# EAGLE design windrain (EAGLE 5.11)
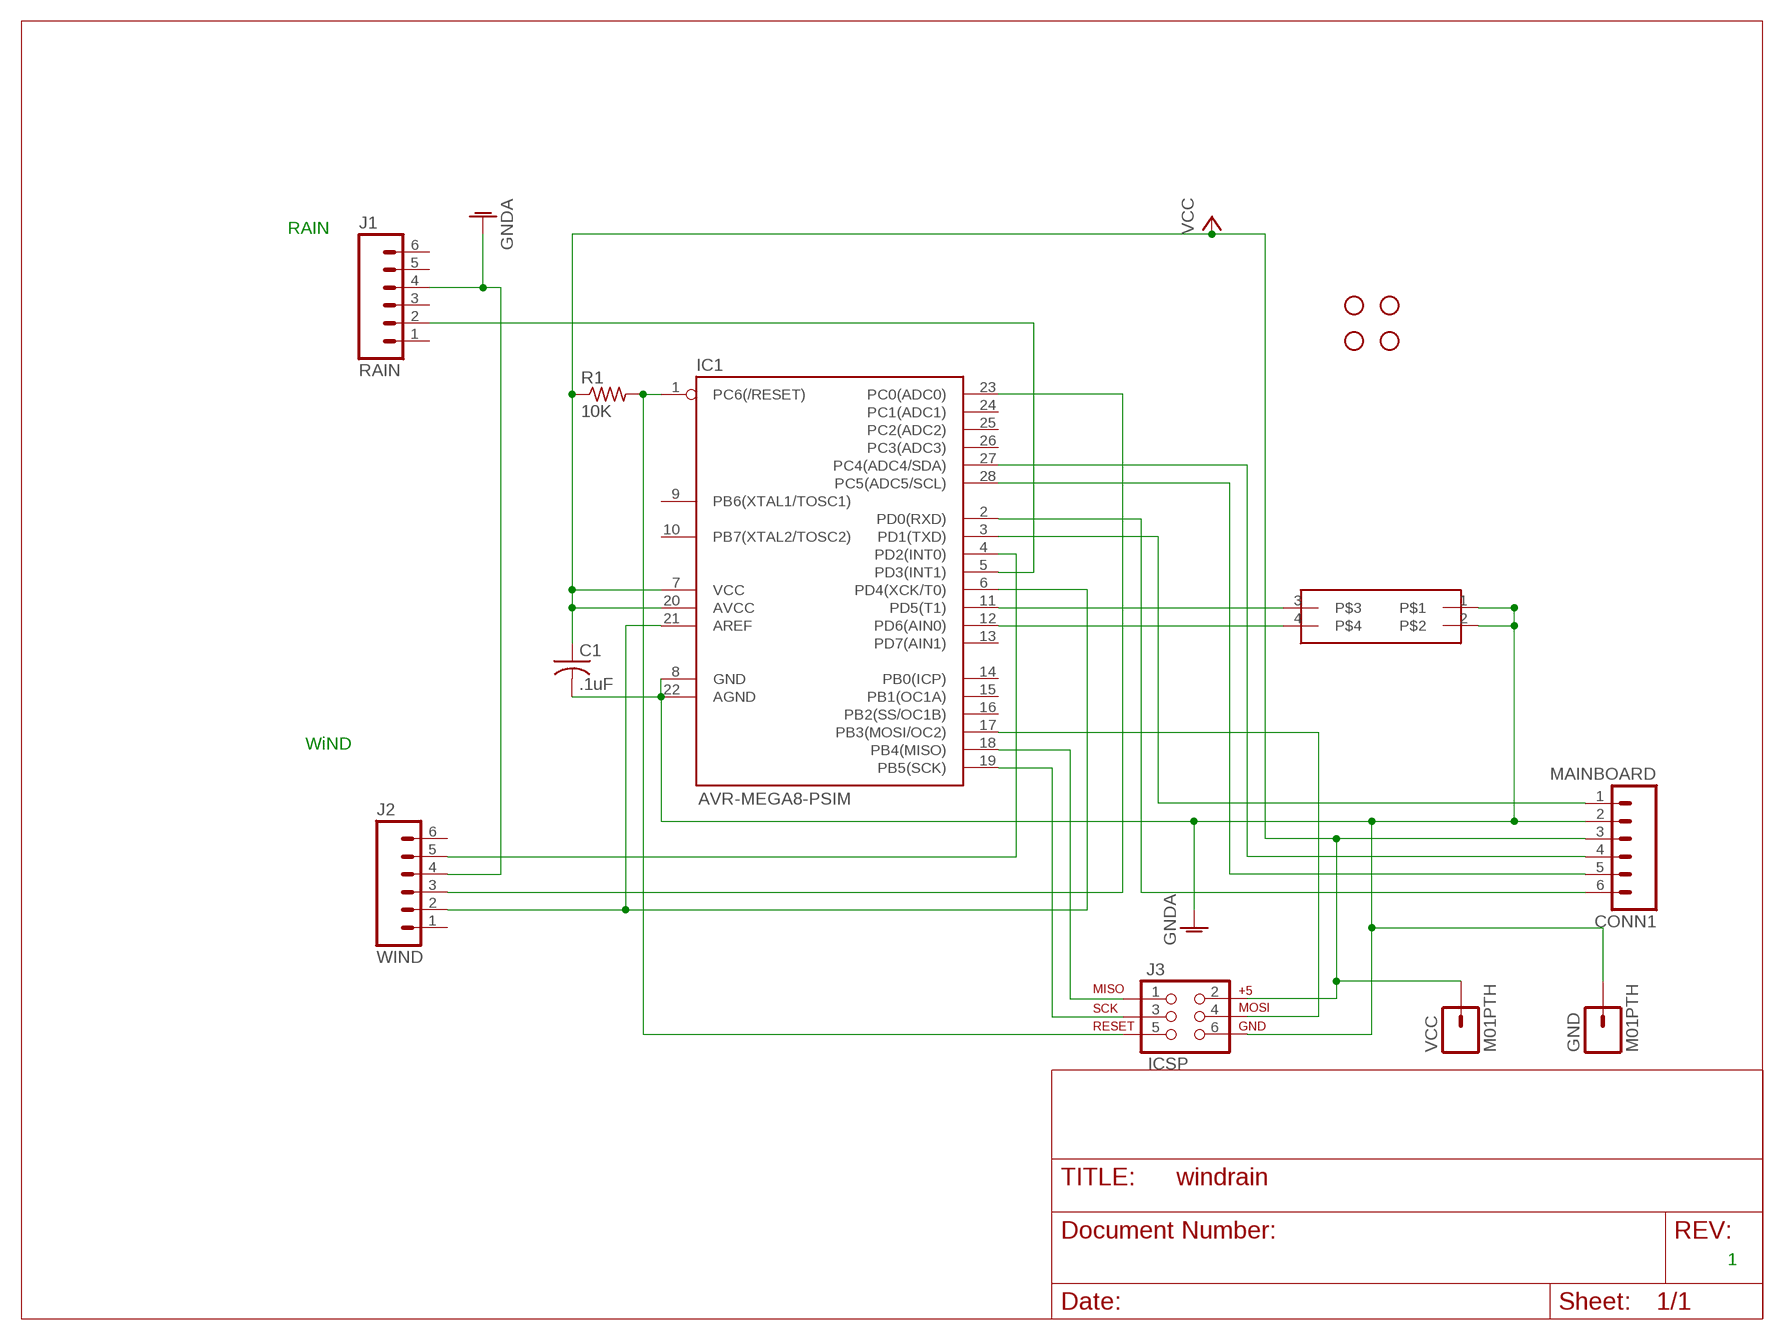
[diagram p0: schematic, sheet 1]

## Parts
C1  .1uF  C-US025-030X050  [C025-030X050]
CONN1  MAINBOARD  M06SIP  [1X06]
GND  M01PTH  [1X01]
IC1  AVR-MEGA8-PSIM  [DIL28-3-SIMON]
J1  RAIN  RJ11-6PTH  [RJ11-6]
J2  WIND  RJ11-6PTH  [RJ11-6]
J3  ICSP  AVR_SPI_PRG_6PTH  [2X3]
JP1  ADDR  PAD2X2  [PAD2X2]
JP2  STAND-OFF  [STAND-OFF]
JP3  STAND-OFF  [STAND-OFF]
JP4  STAND-OFF  [STAND-OFF]
JP5  STAND-OFF  [STAND-OFF]
R1  10K  R-US_0207/7  [0207/7]
VCC  M01PTH  [1X01]

## Nets
GNDA: C1.2 CONN1.2 GND.1 IC1.8(GND) IC1.22(AGND) J1.4 J2.4 J3.6 JP1.1 JP1.2
N$1: IC1.1(PC6(/RESET)) J3.5 R1.2
N$2: IC1.4(PD2(INT0)) J2.5
N$3: IC1.6(PD4(XCK/T0)) IC1.21(AREF) J2.2
N$4: IC1.5(PD3(INT1)) J1.2
N$5: IC1.23(PC0(ADC0)) J2.3
N$6: CONN1.4 IC1.27(PC4(ADC4/SDA))
N$7: CONN1.5 IC1.28(PC5(ADC5/SCL))
N$8: IC1.11(PD5(T1)) JP1.3
N$9: IC1.12(PD6(AIN0)) JP1.4
N$10: CONN1.1 IC1.3(PD1(TXD))
N$11: CONN1.6 IC1.2(PD0(RXD))
N$12: IC1.19(PB5(SCK)) J3.3
N$13: IC1.18(PB4(MISO)) J3.1
N$14: IC1.17(PB3(MOSI/OC2)) J3.4
VCC: C1.1 CONN1.3 IC1.7(VCC) IC1.20(AVCC) J3.2 R1.1 VCC.1
Unconnected: IC1.9(PB6(XTAL1/TOSC1)) IC1.10(PB7(XTAL2/TOSC2)) IC1.13(PD7(AIN1)) IC1.14(PB0(ICP)) IC1.15(PB1(OC1A)) IC1.16(PB2(SS/OC1B)) IC1.24(PC1(ADC1)) IC1.25(PC2(ADC2)) IC1.26(PC3(ADC3)) J1.1 J1.3 J1.5 J1.6 J2.1 J2.6

## Notes on the sheet
- RAIN
- WiND
- 1

## Library data of the parts
C1 = resistor:C-US: CAPACITOR, American symbol
CONN1 = SparkFun:M06: Header 6 Standard 6-pin 0.1" header. Use with straight break away headers (SKU : PRT-00116), right angle break away headers (PRT-00553), swiss pins (PRT-00743), machine pins (PRT-00117), and female headers (PRT-00115). Molex polarized connector foot print use with SKU : PRT-08094 with associated crimp pins and housings. NOTES ON THE VARIANTS LOCK and LOCK_LONGPADS... This footprint was designed to help hold the alignment of a through-hole component (i.e. 6-pin header) while soldering it into place. You may notice that each hole has been shifted either up or down by 0.005 of an inch from it's more standard position (which is a perfectly straight line). This slight alteration caused the pins (the squares in the middle) to touch the edges of the holes. Because they are alternating, it causes a "brace" to hold the component in place. 0.005 has proven to be the perfect amount of "off-center" position when using our standard breakaway headers. Although looks a little odd when you look at the bare footprint, once you have a header in there, the alteration is very hard to notice. Also, if you push a header all the way into place, it is covered up entirely on the bottom side. This idea of altering the position of holes to aid alignment will be further integrated into the Sparkfun Library for other footprints. It can help hold any component with 3 or more connection pins.
GND VCC = SparkFun:M01: Header 1 Standard 1-pin 0.1" header. Use with straight break away headers (SKU : PRT-00116), right angle break away headers (PRT-00553), swiss pins (PRT-00743), machine pins (PRT-00117), and female headers (PRT-00115).
IC1 = SparkFun:AVR-MEGA8-P: MICROCONTROLLER 8 Kbytes FLASH 1 kbytes SRAM 512 bytes EEPROM USART 4-channel 10 bit ADC 2-channel 8 bit ADC
J1 J2 = SparkFun:RJ11-6: RJ11 Jack Simple 6 pin RJ11 jack. Commonly found on CAT3 devices and Microchip programmers. SKU: PRT-00132
J3 = SparkFun:AVR_SPI_PRG_6: AVR ISP 6 Pin This is the reduced ISP connector for AVR programming. Common on Arduino. This footprint will take up less PCB space and can be used with a 10-pin to 6-pin adapter such as SKU: BOB-08508
JP1 = alchemy:PAD2X2
JP2-JP5 = SparkFun:STAND-OFF: Stand Off This is the mechanical footprint for a #4 phillips button head screw. Use the keepout ring to avoid running the screw head into surrounding components. SKU : PRT-00447
R1 = resistor:R-US_: RESISTOR, American symbol

## Board
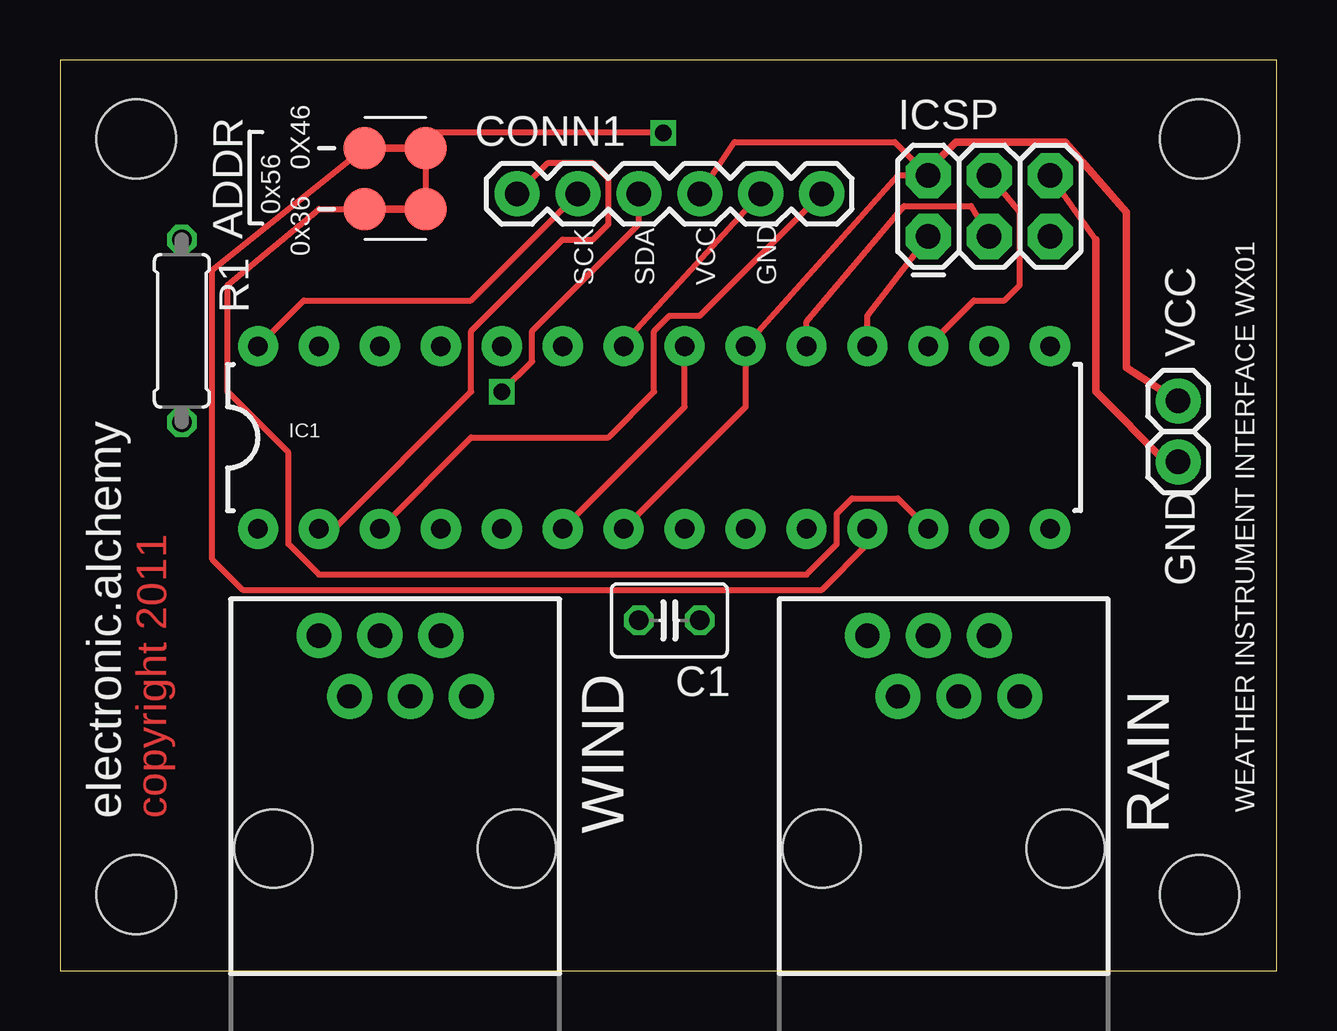
[diagram p1: board, top side]
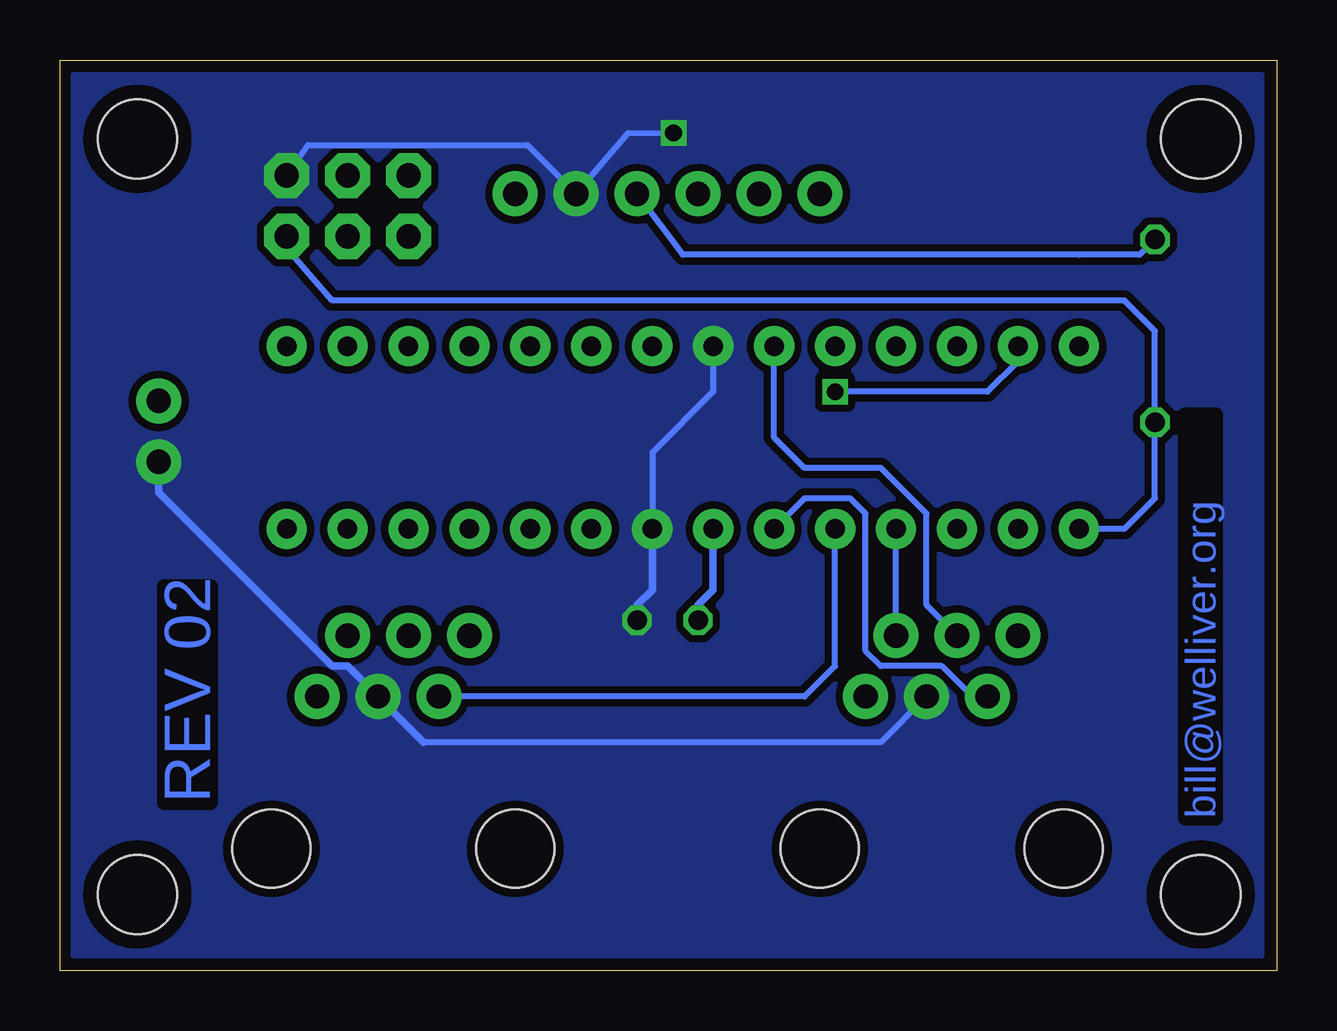
[diagram p2: board, bottom side, seen from below]

Size 50.72 x 37.96 mm. Coordinates in mm from the lower left corner, seen from the top.
Outline: 0,0 50.72,0 50.72,37.96 0,37.96 0,0
Copper layers (1*16): Top 0.0356mm / dielectric 1.5011mm / Bottom 0.0356mm
Design rules "LaenPCBOrder": minimum track width 6mil, minimum drill 13mil, track to track 6mil, track to pad 6mil, pad to pad 6mil, via to via 6mil, smd to smd 6mil, copper to edge 15mil, drill to drill 6mil, minimum pad ring 7mil, minimum via ring 7mil, stop-mask expansion 4mil, vias tented up to drill 0mil, thermal gap 10mil

### Footprints (pad centres in the part's own frame; a part is rotated, then mirrored left to right if it is on the bottom)
C025-030X050 = drill 0.813 octagon: 1 -1.27,0; 2 1.27,0
1X06 = drill 1.016 pad 1.88 round: 1 0,0; 2 2.54,0; 3 5.08,0; 4 7.62,0; 5 10.16,0; 6 12.7,0
1X01 = drill 1.016 pad 1.88 round: 1 0,0
DIL28-3-SIMON = drill 0.813 pad 1.676 round: 1 -16.51,-3.81; 2 -13.97,-3.81; 3 -11.43,-3.81; 4 -8.89,-3.81; 5 -6.35,-3.81; 6 -3.81,-3.81; 7 -1.27,-3.81; 8 1.27,-3.81; 9 3.81,-3.81; 10 6.35,-3.81; 11 8.89,-3.81; 12 11.43,-3.81; 13 13.97,-3.81; 14 16.51,-3.81; 15 16.51,3.81; 16 13.97,3.81; 17 11.43,3.81; 18 8.89,3.81; 19 6.35,3.81; 20 3.81,3.81; 21 1.27,3.81; 22 -1.27,3.81; 23 -3.81,3.81; 24 -6.35,3.81; 25 -8.89,3.81; 26 -11.43,3.81; 27 -13.97,3.81; 28 -16.51,3.81
RJ11-6 = drill 1.016 pad 1.88 round: 1 1.905,8.89; 2 3.175,6.35; 3 4.445,8.89; 4 5.715,6.35; 5 6.985,8.89; 6 8.255,6.35 | hole 3.251: 0,0; 10.16,0
2X3 = drill 1.016 pad 1.88 octagon: 1 0,0; 2 0,2.54; 3 2.54,0; 4 2.54,2.54; 5 5.08,0; 6 5.08,2.54
PAD2X2 = smd 1.778 x 1.778: 1 -1.27,-1.27; 2 -1.27,1.27; 3 1.27,-1.27; 4 1.27,1.27
STAND-OFF = hole 3.302: 0,0
0207/7 = drill 0.813 octagon: 1 -3.81,0; 2 3.81,0

### Placement (x,y rotation side)
C1  25.4,14.61 0 top
CONN1  31.75,32.38 180 top
GND  46.61,21.21 90 top
IC1  24.77,22.23 0 top
J1  31.75,5.08 0 top
J2  8.89,5.08 0 top
J3  36.2,30.61 0 top
JP1  13.97,33.02 180 top
JP2  3.17,3.17 0 top
JP3  3.17,34.67 0 top
JP4  47.5,34.67 0 top
JP5  47.5,3.17 0 top
R1  5.08,26.67 270 top
VCC  46.61,23.75 90 top

### Tracks (layer width: path | path; a pad name or v marks a point on that pad's centre or on a via)
GNDA  (via drill 0.7)
  Top 0.254: 43.18,30.48 J3.6 | CONN1.2 23.57,26.23 IC1.22 | JP1.2 JP1.1 15.24,34.92 v25.15,34.92
  Top 0.305: 43.18,30.48 43.18,24.13 46.1,21.21 GND.1
  Bottom 0.254: J2.4 16.51,9.53 35.56,9.53 J1.4 38.1,11.43 | IC1.8 26.04,21.59 23.5,24.13 IC1.22 | J3.6 40.39,34.42 31.24,34.42 CONN1.2 27.05,34.92 v25.15,34.92
  Bottom 0.305: IC1.8 26.04,15.88 26.67,15.24 C1.2 | 35.56,9.53 38.73,12.7 39.37,12.7 46.61,19.94 GND.1
  pour Bottom (isolate 0.305, no thermals): 0.64,37.34 50.16,37.34 50.16,0.64 0.64,0.64
N$1
  Bottom 0.254: J3.5 41.15,29.97 39.37,27.94 6.35,27.94 5.08,26.67 R1.2 5.08,19.68 6.35,18.41 IC1.1
N$2
  Bottom 0.254: J2.5 IC1.4
N$3
  Top 0.254: IC1.6 26.04,23.5 IC1.21
  Bottom 0.254: J2.2 12.7,11.43 13.97,12.7 16.51,12.7 17.14,13.34 17.14,19.05 17.78,19.68 19.68,19.68 IC1.6
N$4
  Bottom 0.254: IC1.5 18.41,12.7 19.68,11.43 J1.2
N$5
  Bottom 0.254: J2.3 14.61,15.24 14.61,19.05 16.51,20.95 19.68,20.95 20.95,22.23 IC1.23
N$6  (via drill 0.7)
  Top 0.254: CONN1.4 24.13,31.11 19.68,26.67 19.68,25.4 v18.41,24.13
  Bottom 0.254: v18.41,24.13 12.06,24.13 10.79,25.4 IC1.27
N$7
  Top 0.254: CONN1.5 17.14,27.94 10.16,27.94 IC1.28
N$8
  Top 0.254: JP1.3 6.35,29.21 6.35,17.14 7.62,15.88 31.75,15.88 33.66,17.78 IC1.11
N$9
  Top 0.254: IC1.12 34.92,19.68 33.02,19.68 32.38,19.05 32.38,17.78 31.11,16.51 10.79,16.51 9.53,17.78 9.53,21.59 6.99,24.13 6.99,28.57 10.79,31.75 JP1.4
N$10
  Top 0.254: CONN1.1 29.84,30.48 26.67,27.3 25.4,27.3 24.77,26.67 24.77,24.13 22.86,22.23 17.14,22.23 IC1.3
N$11
  Top 0.254: CONN1.6 20.32,33.66 22.23,33.66 22.86,33.02 22.86,31.11 22.23,30.48 20.95,30.48 17.14,26.67 17.14,24.13 11.43,18.41 IC1.2
N$12
  Top 0.254: J3.3 37.97,31.88 35.18,31.88 31.11,27.05 IC1.19
N$13
  Top 0.254: J3.1 33.66,27.3 IC1.18
N$14
  Top 0.254: J3.4 40.01,31.62 40.01,28.57 39.37,27.94 38.1,27.94 IC1.17
VCC
  Top 0.254: IC1.7 28.57,23.5 IC1.20 34.92,33.15 J3.2 | CONN1.3 28.12,34.54 34.8,34.54 36.07,33.27
  Top 0.305: VCC.1 44.45,25.15 44.45,31.62 41.91,34.54 37.34,34.54 36.07,33.27 J3.2
  Bottom 0.254: R1.1 5.71,29.84 8.26,29.84 24.77,29.84 CONN1.3
  Bottom 0.305: IC1.7 23.5,15.88 24.13,15.24 C1.1

### Text on the board
Top: copyright 2011
Bottom: REV 02 | bill@welliver.org
tPlace: 0X46 | 0x56 | 0x36 | SCK | SDA | VCC | GND | WEATHER INSTRUMENT INTERFACE WX01 | electronic.alchemy | WIND | RAIN